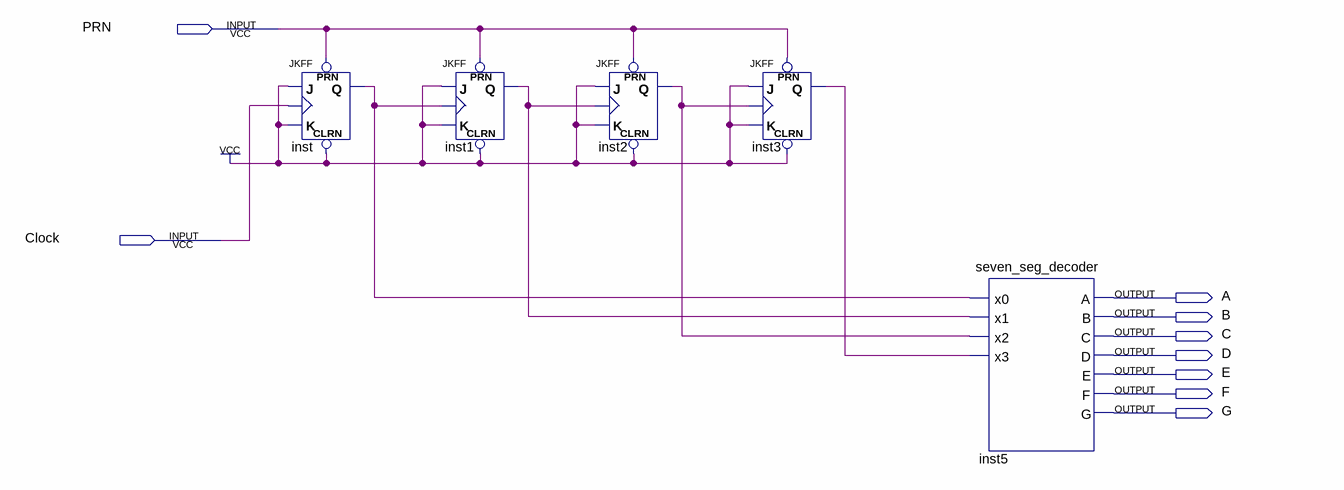
[diagram p0: schematic sheet]
// Quartus schematic lab10step3b.bdf as structural Verilog: 5 symbols, 9 pins
module lab10step3b (
  input  PRN,
  input  Clock,
  output A,
  output B,
  output C,
  output D,
  output E,
  output F,
  output G
);

  wire inst1_q, inst2_q, inst3_q, inst_q;

  JKFF inst (.PRN(PRN), .CLRN(1'b1), .K(1'b1), .J(1'b1), .CLK(Clock), .Q(inst_q));
  JKFF inst1 (.PRN(PRN), .CLRN(1'b1), .K(1'b1), .J(1'b1), .CLK(inst_q), .Q(inst1_q));
  JKFF inst2 (.PRN(PRN), .CLRN(1'b1), .K(1'b1), .J(1'b1), .CLK(inst1_q), .Q(inst2_q));
  JKFF inst3 (.PRN(PRN), .CLRN(1'b1), .K(1'b1), .J(1'b1), .CLK(inst2_q), .Q(inst3_q));
  seven_seg_decoder inst5 (
    .x0(inst_q), .x1(inst1_q), .x2(inst2_q), .x3(inst3_q), .A(A), .B(B), .C(C), .D(D), .E(E), .F(F), .G(G));
endmodule
